# Altium schematic sheet power_phase.schdoc: Phase
size A3; Revision: 1; SheetNumber: 2; SheetTotal: 2
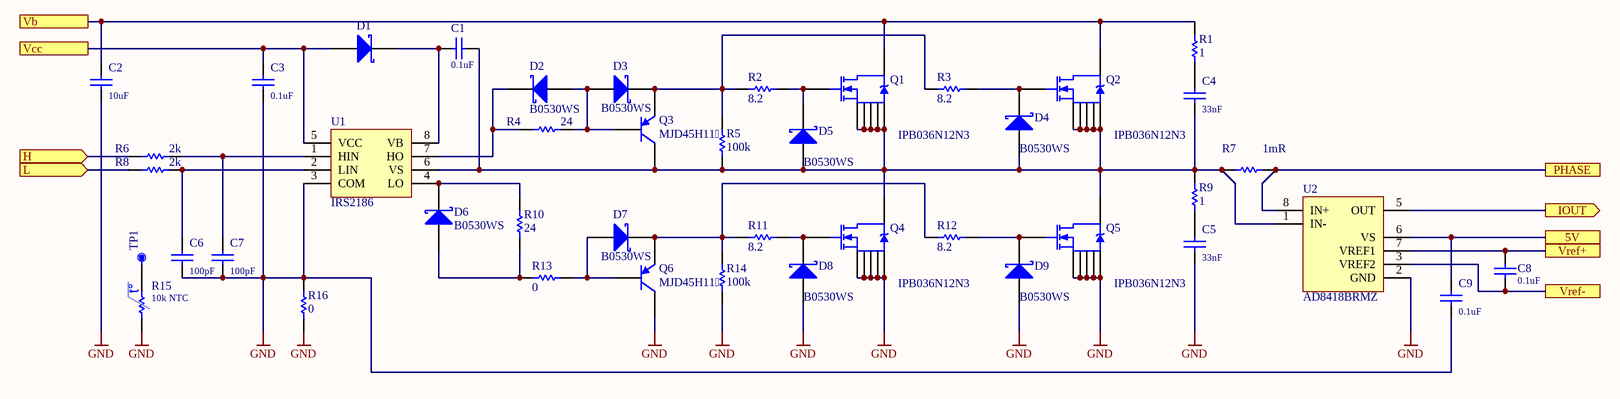
[diagram p0: power_phase.schdoc]

## Parts
C1  0.1uF  [C0805_L]
C2  10uF  [C2220]
C3  0.1uF  [C0603]
C4  33nF  [C0805]
C5  33nF  [C0805]
C6  100pF  [C0402]
C7  100pF  [C0402]
C8  0.1uF  [C0402]
C9  0.1uF  [C0402]
D1  (no value)  [SOD-323]
D2  B0530WS  [SOD-323]
D3  B0530WS  [SOD-323]
D4  B0530WS  [SOD-323]
D5  B0530WS  [SOD-323]
D6  B0530WS  [SOD-323]
D7  B0530WS  [SOD-323]
D8  B0530WS  [SOD-323]
D9  B0530WS  [SOD-323]
Q1  IPB036N12N3  [TO-263-7]
Q2  IPB036N12N3  [TO-263-7]
Q3  MJD45H11  [TO-252AA]
Q4  IPB036N12N3  [TO-263-7]
Q5  IPB036N12N3  [TO-263-7]
Q6  MJD45H11  [TO-252AA]
R1  1  [R1206]
R2  8.2  [R0805]
R3  8.2  [R0805]
R4  24  [R0603]
R5  100k  [R0805]
R6  2k  [R0603]
R7  1mR  [RES_CSS2H-3920R]
R8  2k  [R0603]
R9  1  [R1206]
R10  24  [R0603]
R11  8.2  [R0805]
R12  8.2  [R0805]
R13  0  [R1206]
R14  100k  [R0805]
R15  10k NTC  [R0402]
R16  0  [R1206]
TP1  (no value)  [TP2030_SMD]  (no BOM)
U1  IRS2186  [SO-8]
U2  AD8418BRMZ  [MSOP8]

## Ports
5V, H (in), IOUT (out), L (in), PHASE, Vb, Vcc, Vref+, Vref-

## Nets
GND: C2.1 C3.1 C5.1 C6.1 C7.1 C9.1 D8.1(A) D9.1(A) Q4.2(S) Q4.3(S) Q4.5(S) Q4.6(S) Q4.7(S) Q5.2(S) Q5.3(S) Q5.5(S) Q5.6(S) Q5.7(S) Q6.2(C) R14.2 R15.2 R16.1 R16.2 U1.3(COM) U2.2(GND)
5V: C9.2 U2.6(VS) ; port 5V
H: R6.2 ; port H
IOUT: U2.5(OUT) ; port IOUT
L: R8.2 ; port L
PHASE: R7.2 U2.8(IN+) ; port PHASE
Vb: C2.2 Q1.4(D) Q2.4(D) R1.2 ; port Vb
Vcc: C3.2 D1.1(A) U1.5(VCC) ; port Vcc
Vref+: C8.2 U2.7(VREF1) ; port Vref+
Vref-: C8.1 U2.3(VREF2) ; port Vref-
NetC1_1: C1.1 D1.2(K) U1.8(VB)
NetC1_2: C1.2 C4.1 D4.1(A) D5.1(A) Q1.2(S) Q1.3(S) Q1.5(S) Q1.6(S) Q1.7(S) Q2.2(S) Q2.3(S) Q2.5(S) Q2.6(S) Q2.7(S) Q3.2(C) Q4.4(D) Q5.4(D) R5.2 R7.1 R9.2 U1.6(VS) U2.1(IN-)
NetC4_2: C4.2 R1.1
NetC5_2: C5.2 R9.1
NetC6_2: C6.2 R8.1 U1.2(LIN)
NetC7_2: C7.2 R6.1 U1.1(HIN)
NetD2_1: D2.1(A) D3.1(A) Q3.1(B) R4.1
NetD2_2: D2.2(K) R4.2 U1.7(HO)
NetD3_2: D3.2(K) Q3.3(E) R2.1 R3.1 R5.1
NetD4_2: D4.2(K) Q2.1(G) R3.2
NetD5_2: D5.2(K) Q1.1(G) R2.2
NetD6_1: D6.1(A) R10.1 R13.2
NetD6_2: D6.2(K) R10.2 U1.4(LO)
NetD7_1: D7.1(A) Q6.1(B) R13.1
NetD7_2: D7.2(K) Q6.3(E) R11.1 R12.1 R14.1
NetD8_2: D8.2(K) Q4.1(G) R11.2
NetD9_2: D9.2(K) Q5.1(G) R12.2
NetR15_1: R15.1 TP1.1

## Notes on the sheet
- (in symbol RES) t°

## Library data of the parts
C1 C3 C8 C9 = CAP: 0.1uF 50V 0603
C2 = CAP: 10uF 100V 2220
C4 C5 = CAP: 33nF 100V 1206
C6 C7 = CAP: 100pF 50V 0402
D1 = Diode 10TQ035_1: 100V SOD-323
D2-D9 = Diode 10TQ035_1: Schottky 0.5A 30V SOD-323
Q1 Q2 Q4 Q5 = NMOS-2: IPB036N12N3GATMA1
Q3 Q6 = PNP: PNP Bipolar Transistor
R1 R9 = Res1: 1R 5% 1206
R2 R3 R11 R12 = Res1: 8.2R 5% 0805
R4 R10 = Res1: 24R 5% 0603
R5 R14 = Res1: 100k 5% 0805
R6 R8 = Res1: 2k 5% 0603
R7 = Res1: 1mR 3920R
R13 R16 = Res1: 0 2512
R15 = RES: 10k NTC 3434 0402
TP1 = TP_Dup1
U1 = IRS2186: IR2186
U2 = AD8418BRMZ: Bidirectional, Zero Drift, Current Sense Amplifier